# EAGLE schematic ICE_motherboard (EAGLE 5.06)
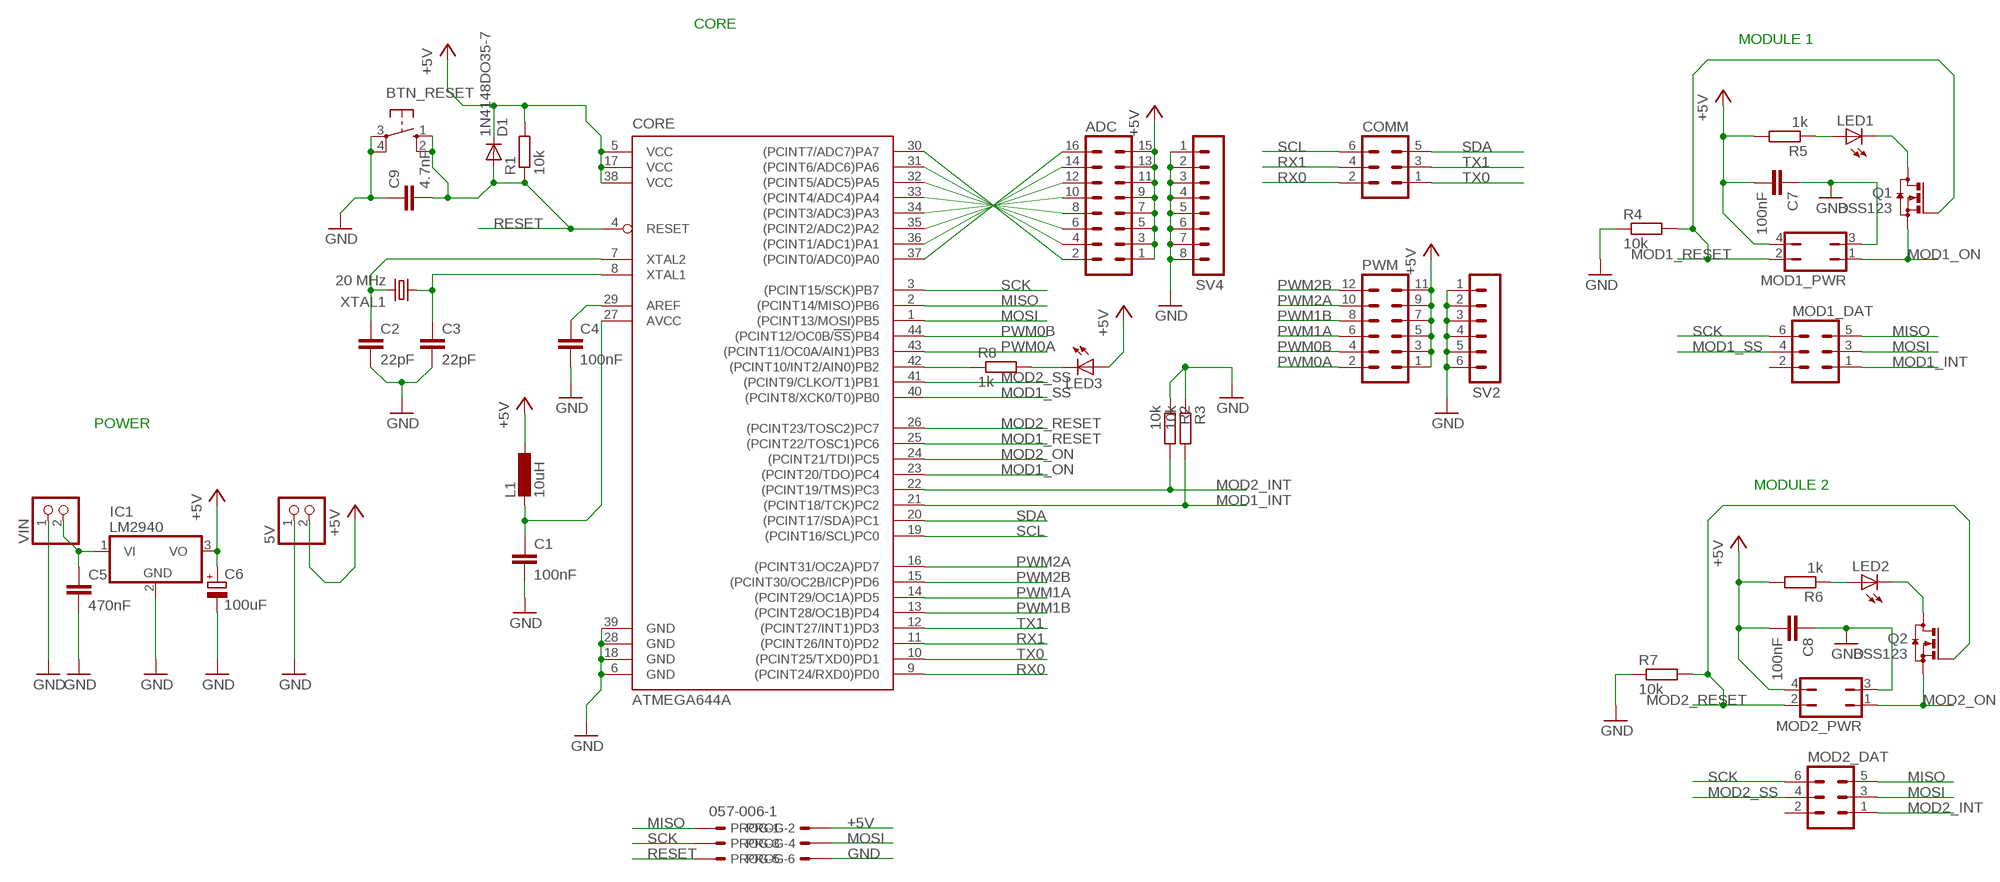
[diagram p0: schematic, sheet 1]

## Parts
5V  PINHD-1X2  [1X02]
ADC  MA08-2  [MA08-2]
BTN_RESET  10-XX  [B3F-10XX]
C1  100nF  C-EUC0805K  [C0805K]
C2  22pF  C-EUC0805K  [C0805K]
C3  22pF  C-EUC0805K  [C0805K]
C4  100nF  C-EUC0805K  [C0805K]
C5  470nF  C-EUC0805K  [C0805K]
C6  100uF  CPOL-EUE5-4  [E5-4]
C7  100nF  C-EUC0805K  [C0805K]
C8  100nF  C-EUC0805K  [C0805K]
C9  4.7nF  C-EUC0805K  [C0805K]
COMM  MA03-2  [MA03-2]
CORE  ATMEGA644A  [TQFP44]
D1  1N4148DO35-7  [DO35-7]
IC1  LM2940  7815T  [TO220H]
L1  10uH  L-EUL0805  [L0805]
LED1  LEDCHIPLED_0805  [CHIPLED_0805]
LED2  LEDCHIPLED_0805  [CHIPLED_0805]
LED3  LEDCHIPLED_0805  [CHIPLED_0805]
MOD1_DAT  MA03-2  [MA03-2]
MOD1_PWR  JP2Q  [JP2Q]
MOD2_DAT  MA03-2  [MA03-2]
MOD2_PWR  JP2Q  [JP2Q]
PROG  057-006-1  [057-006-1]
PWM  MA06-2  [MA06-2]
Q1  BSS123  [SOT23]
Q2  BSS123  [SOT23]
R1  10k  R-EU_R0805W  [R0805W]
R2  10k  R-EU_R0805W  [R0805W]
R3  10k  R-EU_R0805W  [R0805W]
R4  10k  R-EU_R0805W  [R0805W]
R5  1k  R-EU_R0805W  [R0805W]
R6  1k  R-EU_R0805W  [R0805W]
R7  10k  R-EU_R0805W  [R0805W]
R8  1k  R-EU_R0805W  [R0805W]
SV2  MA06-1  [MA06-1]
SV4  MA08-1  [MA08-1]
VIN  PINHD-1X2  [1X02]
XTAL1  20 MHz  CRYSTALHC49S  [HC49/S]

## Nets
+5V: 5V.2 ADC.1 ADC.3 ADC.5 ADC.7 ADC.9 ADC.11 ADC.13 ADC.15 C6.+ C7.2 C8.2 CORE.5(VCC) CORE.17(VCC) CORE.38(VCC) D1.C IC1.3(VO) L1.1 LED3.A MOD1_PWR.4 MOD2_PWR.4 PROG.2 PWM.1 PWM.3 PWM.5 PWM.7 PWM.9 PWM.11 R1.2 R5.2 R6.2
BAT+: C5.1 IC1.1(VI) VIN.2
GND: 5V.1 BTN_RESET.3(P) BTN_RESET.4(P1) C1.2 C2.2 C3.2 C4.2 C5.2 C6.- C7.1 C8.1 C9.1 CORE.6(GND) CORE.18(GND) CORE.28(GND) CORE.39(GND) IC1.2(GND) MOD1_PWR.3 MOD2_PWR.3 PROG.6 R2.1 R3.1 R4.1 R7.1 SV2.1 SV2.2 SV2.3 SV2.4 SV2.5 SV2.6 SV4.1 SV4.2 SV4.3 SV4.4 SV4.5 SV4.6 SV4.7 SV4.8 VIN.1
MISO: CORE.2((PCINT14/MISO)PB6) MOD1_DAT.5 MOD2_DAT.5 PROG.1
MOD1_INT: CORE.21((PCINT18/TCK)PC2) MOD1_DAT.1 R3.2
MOD1_ON: CORE.23((PCINT20/TDO)PC4) MOD1_PWR.1 Q1.2(S)
MOD1_RESET: CORE.25((PCINT22/TOSC1)PC6) MOD1_PWR.2 Q1.1(G) R4.2
MOD1_SS: CORE.40((PCINT8/XCK0/T0)PB0) MOD1_DAT.4
MOD2_INT: CORE.22((PCINT19/TMS)PC3) MOD2_DAT.1 R2.2
MOD2_ON: CORE.24((PCINT21/TDI)PC5) MOD2_PWR.1 Q2.2(S)
MOD2_RESET: CORE.26((PCINT23/TOSC2)PC7) MOD2_PWR.2 Q2.1(G) R7.2
MOD2_SS: CORE.41((PCINT9/CLKO/T1)PB1) MOD2_DAT.4
MOSI: CORE.1((PCINT13/MOSI)PB5) MOD1_DAT.3 MOD2_DAT.3 PROG.4
N$1: CORE.42((PCINT10/INT2/AIN0)PB2) R8.1
N$2: C2.1 CORE.7(XTAL2) XTAL1.2
N$4: C4.1 CORE.29(AREF)
N$5: ADC.16 CORE.37((PCINT0/ADC0)PA0)
N$6: ADC.14 CORE.36((PCINT1/ADC1)PA1)
N$7: ADC.12 CORE.35((PCINT2/ADC2)PA2)
N$8: ADC.10 CORE.34((PCINT3/ADC3)PA3)
N$9: ADC.8 CORE.33((PCINT4/ADC4)PA4)
N$10: ADC.6 CORE.32((PCINT5/ADC5)PA5)
N$11: ADC.4 CORE.31((PCINT6/ADC6)PA6)
N$12: ADC.2 CORE.30((PCINT7/ADC7)PA7)
N$13: LED2.C Q2.3(D)
N$14: LED3.C R8.2
N$15: C1.1 CORE.27(AVCC) L1.2
N$16: C3.1 CORE.8(XTAL1) XTAL1.1
N$17: LED1.C Q1.3(D)
PWM0A: CORE.43((PCINT11/OC0A/AIN1)PB3) PWM.2
PWM0B: CORE.44((PCINT12/OC0B/!SS!)PB4) PWM.4
PWM1A: CORE.14((PCINT29/OC1A)PD5) PWM.6
PWM1B: CORE.13((PCINT28/OC1B)PD4) PWM.8
PWM2A: CORE.16((PCINT31/OC2A)PD7) PWM.10
PWM2B: CORE.15((PCINT30/OC2B/ICP)PD6) PWM.12
R1: LED2.A R6.1
R5: LED1.A R5.1
RESET: BTN_RESET.1(S) BTN_RESET.2(S1) C9.2 CORE.4(RESET) D1.A PROG.5 R1.1
RX0: COMM.2 CORE.9((PCINT24/RXD0)PD0)
RX1: COMM.4 CORE.11((PCINT26/INT0)PD2)
SCK: CORE.3((PCINT15/SCK)PB7) MOD1_DAT.6 MOD2_DAT.6 PROG.3
SCL: COMM.6 CORE.19((PCINT16/SCL)PC0)
SDA: COMM.5 CORE.20((PCINT17/SDA)PC1)
TX0: COMM.1 CORE.10((PCINT25/TXD0)PD1)
TX1: COMM.3 CORE.12((PCINT27/INT1)PD3)
Unconnected: MOD1_DAT.2 MOD2_DAT.2

## Notes on the sheet
- CORE
- MODULE 1
- POWER
- MODULE 2

## Library data of the parts
5V VIN = pinhead:PINHD-1X2: PIN HEADER
ADC = con-lstb:MA08-2: PIN HEADER
BTN_RESET = switch-omron:10-XX: OMRON SWITCH
C1-C5 C7-C9 = rcl:C-EU: CAPACITOR, European symbol
C6 = rcl:CPOL-EU: POLARIZED CAPACITOR, European symbol
COMM MOD1_DAT MOD2_DAT = con-lstb:MA03-2: PIN HEADER
CORE = atmel:ATMEGA644: 8-bit Microcontroller with 64K Bytes In-System Programmable Flash Source: http://www.atmel.com/dyn/resources/prod_documents/doc2593.pdf
D1 = diode:1N4148: DIODE high speed (Philips)
IC1 = linear:78*: Positive VOLTAGE REGULATOR Source: http://cache.national.com/ds/LM/LM78L05.pdf http://www.fairchildsemi.com/ds/LM/LM7805.pdf
L1 = rcl:L-EU: INDUCTOR, European symbol
LED1-LED3 = led:LED: LED OSRAM: - CHIPLED LG R971, LG N971, LY N971, LG Q971, LY Q971, LO R971, LY R971 LH N974, LH R974 LS Q976, LO Q976, LY Q976 LO Q996 - Hyper CHIPLED LW Q18S LB Q993, LB Q99A, LB R99A - SideLED LS A670, LO A670, LY A670, LG A670, LP A670 LB A673, LV A673, LT A673, LW A673 LH A674 LY A675 LS A676, LA A676, LO A676, LY A676, LW A676 LS A679, LY A679, LG A679 - Hyper Micro SIDELED® LS Y876, LA Y876, LO Y876, LY Y876 LT Y87S - SmartLED LW L88C, LW L88S LB L89C, LB L89S, LG L890 LS L89K, LO L89K, LY L89K LS L896, LA L896, LO L896, LY L896 - TOPLED LS T670, LO T670, LY T670, LG T670, LP T670 LSG T670, LSP T670, LSY T670, LOP T670, LYG T670 LG T671, LOG T671, LSG T671 LB T673, LV T673, LT T673, LW T673 LH T674 LS T676, LA T676, LO T676, LY T676, LB T676, LH T676, LSB T676, LW T676 LB T67C, LV T67C, LT T67C, LS T67K, LO T67K, LY T67K, LW E67C LS E67B, LA E67B, LO E67B, LY E67B, LB E67C, LV E67C, LT E67C LW T67C LS T679, LY T679, LG T679 LS T770, LO T770, LY T770, LG T770, LP T770 LB T773, LV T773, LT T773, LW T773 LH T774 LS E675, LA E675, LY E675, LS T675 LS T776, LA T776, LO T776, LY T776, LB T776 LHGB T686 LT T68C, LB T68C - Hyper Mini TOPLED® LB M676 - Mini TOPLED Santana® LG M470 LS M47K, LO M47K, LY M47K Source: http://www.osram.convergy.de LUXEON: - LUMILED® LXK2-PW12-R00, LXK2-PW12-S00, LXK2-PW14-U00, LXK2-PW14-V00 LXK2-PM12-R00, LXK2-PM12-S00, LXK2-PM14-U00 LXK2-PE12-Q00, LXK2-PE12-R00, LXK2-PE12-S00, LXK2-PE14-T00, LXK2-PE14-U00 LXK2-PB12-K00, LXK2-PB12-L00, LXK2-PB12-M00, LXK2-PB14-N00, LXK2-PB14-P00, LXK2-PB14-Q00 LXK2-PR12-L00, LXK2-PR12-M00, LXK2-PR14-Q00, LXK2-PR14-R00 LXK2-PD12-Q00, LXK2-PD12-R00, LXK2-PD12-S00 LXK2-PH12-R00, LXK2-PH12-S00 LXK2-PL12-P00, LXK2-PL12-Q00, LXK2-PL12-R00 Source: www.luxeon.com KINGBRIGHT: KA-3528ASYC Source: www.kingbright.com
MOD1_PWR MOD2_PWR = jumper:JP2Q: JUMPER
PROG = con-panduit:057-006-: CONNECTOR 6-pin series 057 contact pc board low profile headers
PWM = con-lstb:MA06-2: PIN HEADER
Q1 Q2 = transistor-small-signal:BSS123: N-CHANNEL MOS FET
R1-R8 = rcl:R-EU_: RESISTOR, European symbol
SV2 = con-lstb:MA06-1: PIN HEADER
SV4 = con-lstb:MA08-1: PIN HEADER
XTAL1 = crystal:CRYSTAL: CRYSTAL